# Altium schematic sheet In_Amp.SchDoc
size A
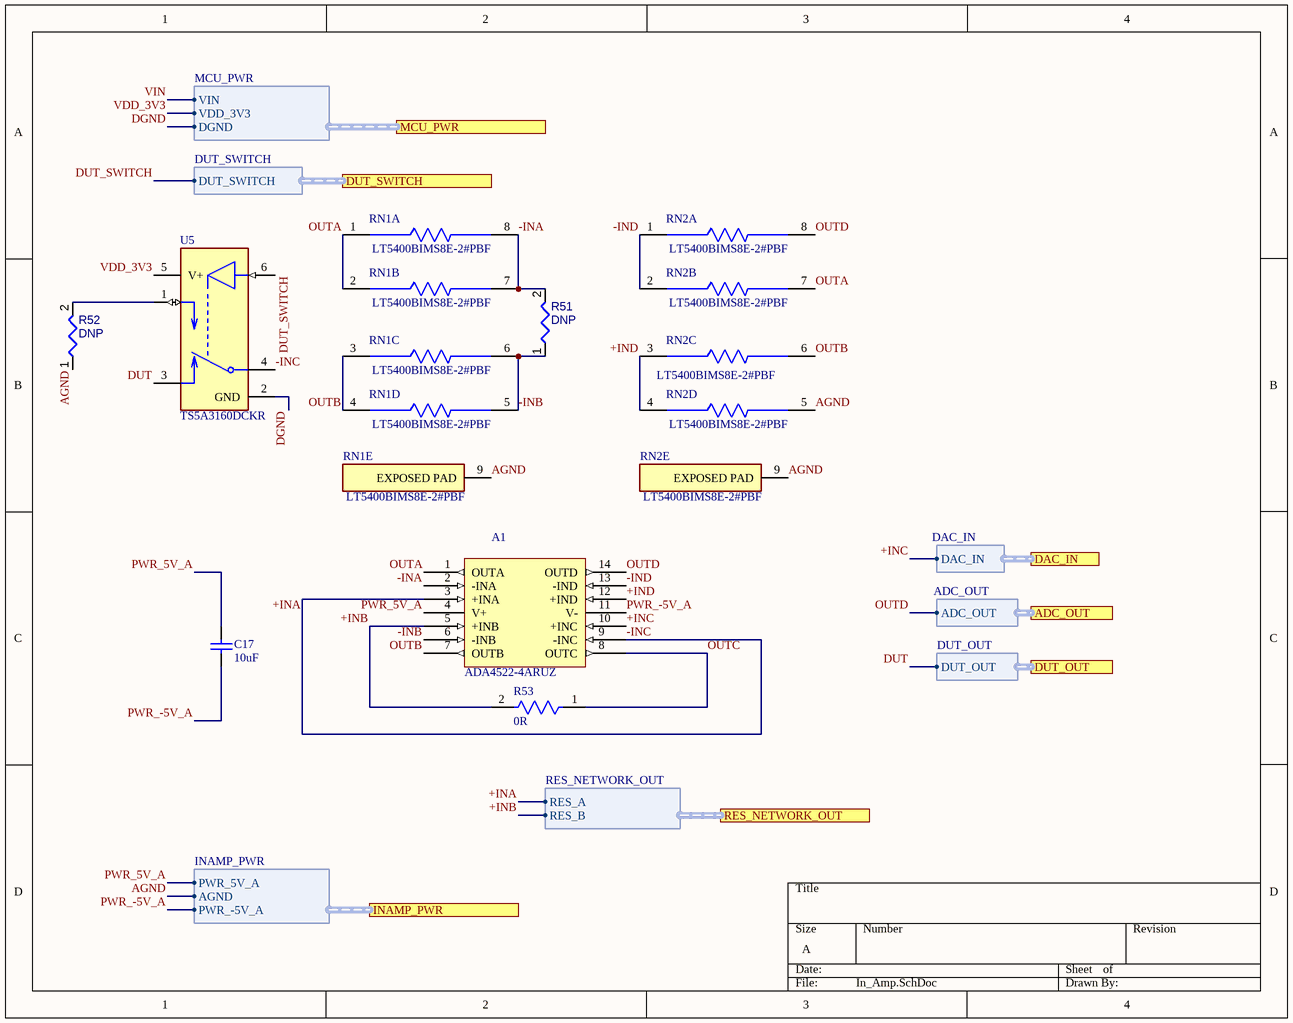
[diagram p0: In_Amp.SchDoc]

## Parts
A1  ADA4522-4ARUZ  [TSSOP14]
C17  10uF  [CAPC2013X135X45ML10T25]
R51  DNP  [RESC1608X55X25ML10T15]
R52  DNP  [RESC1608X55X25ML10T15]
R53  0R  [FP-CR0603-MFG]
RN1  LT5400BIMS8E-2#PBF  [FP-MS8E-8-05-08-1662-MFG]  (parts A,B,C,D,E of 5)
RN2  LT5400BIMS8E-2#PBF  [FP-MS8E-8-05-08-1662-MFG]  (parts A,B,C,D,E of 5)
U5  TS5A3160DCKR  [FP-DCK0006A-MFG]

## Ports
ADC_OUT (harness ADC_OUT), DAC_IN (harness DAC_IN), DUT_OUT (harness DUT_OUT), DUT_SWITCH (harness DUT_SWITCH), INAMP_PWR (harness INAMP_PWR), MCU_PWR (harness MCU_PWR), RES_NETWORK_OUT (harness RES_NETWORK_OUT)

## Harnesses
RES_NETWORK_OUT: RES_A, RES_B
DUT_OUT: DUT_OUT
INAMP_PWR: AGND, PWR_-5V_A, PWR_5V_A
MCU_PWR: VDD_3V3, DGND, VIN
DUT_SWITCH: DUT_SWITCH
DAC_IN: DAC_IN
ADC_OUT: ADC_OUT

## Nets
+INA: A1.3(+INA) A1.9(-INC) U5.4(COM) ; port RES_NETWORK_OUT.RES_A  [also labelled -INC]
+INB: A1.5(+INB) R53.2 ; port RES_NETWORK_OUT.RES_B
+INC: A1.10(+INC) ; port DAC_IN.DAC_IN
+IND: A1.12(+IND) RN2.3(1_R3) RN2.4(1_R4)
-INA: A1.2(-INA) R51.2 RN1.7(2_R2) RN1.8(2_R1)
-INB: A1.6(-INB) R51.1 RN1.5(2_R4) RN1.6(2_R3)
-IND: A1.13(-IND) RN2.1(1_R1) RN2.2(1_R2)
AGND: R52.1 RN1.9(EXPOSED_PAD) RN2.5(2_R4) RN2.9(EXPOSED_PAD) ; port INAMP_PWR.AGND
DGND: U5.2(GND) ; port MCU_PWR.DGND
DUT: U5.3(NC) ; port DUT_OUT.DUT_OUT
DUT_SWITCH: U5.6(IN) ; port DUT_SWITCH.DUT_SWITCH
OUTA: A1.1(OUTA) RN1.1(1_R1) RN1.2(1_R2) RN2.7(2_R2)
OUTB: A1.7(OUTB) RN1.3(1_R3) RN1.4(1_R4) RN2.6(2_R3)
OUTC: A1.8(OUTC) R53.1
OUTD: A1.14(OUTD) RN2.8(2_R1) ; port ADC_OUT.ADC_OUT
PWR_5V_A: A1.4(V+) C17.2 ; port INAMP_PWR.PWR_5V_A
PWR_-5V_A: A1.11(V-) C17.1 ; port INAMP_PWR.PWR_-5V_A
VDD_3V3: U5.5(V+) ; port MCU_PWR.VDD_3V3
VIN: port MCU_PWR.VIN
NetR52_2: R52.2 U5.1(NO)

## Library data of the parts
A1 = AD4522-4ARUZ: Manufacturer 1: Analog Devices; Manufacturer Part Number 1: ADA4522-4ARUZ-R7; Supplier 1: Digi-Key; Supplier Part Number 1: ADA4522-4ARUZ-R7CT-ND; Supplier Unit Price 1: 8.45000
C17 = CMP-2007-03541-1: Part Number: GRM21BR61E106KA73L; Manufacturer: Murata
R51 R52 = CMP-009-00023-4: do not place
R53 = CMP-07231-000023-1: Thick Film Chip Resistors 0603 0Ω 0.1W 5%; Power Rating: 100mW; Resistance: 0mR; Voltage Rating (DC): 50V; Tolerance: 1%; Temperature Coefficient: 500ppm/°C; Depth: 0.8mm; Height: 0.45mm; Case Code (Metric): 1608; Number of Pins: 2; Max Operating Temperature: 155°C; Mount: Surface Mount; REACH SVHC: No SVHC; Radiation Hardening: No; Width: 0.8mm; Max Power Dissipation: 100mW; Thickness: 457um; Package Quantity: 5000; Composition: Thick Film; Case/Package: 0603; Military Standard: Not; Packaging: Tape and Reel; Voltage Rating: 50V; Case Code (Imperial): 0603; Min Operating Temperature: -55°C; Contact Plating: Tin; Length: 1.6mm; Termination: SMD/SMT
RN1 RN2 = CMP-09039-000001-1: RES ARRAY 4 RES 1K OHM 8TSSOP; Manufacturer: Analog Devices; Standoff Height: 0.0508mm; Power Per Resistor: 800mW; Number Of Resistors: 4; Resistance: 1kΩ; Voltage Rating: 75V; Tolerance: 15%; Value: 100K; Temperature Coefficient: 8ppm/°C; Height: 1.1mm; Octopart: https://octopart.com/lt5400ahms8e-4%23pbf-analog+devices-88940367; Package: MS8E-8-05-08-1662; ComponentLink2URL: https://www.analog.com/media/en/technical-documentation/data-sheets/5400fc.pdf; Automotive: No; Temperature Range Low: -40°C; Digikey Description: RES ARRAY 4 RES 1K OHM 8TSSOP; Lead Free: Yes; Ipc Land Pattern Name: SOP65P490X110-8; Device Class L1: Passive Components; Category: Res; ComponentLink2Description: Datasheet; RoHS: TRUE; Device Class L2: Resistors; Device Class L3: Resistor Arrays; Termination: Gull-Wing; Series: LT5400; Manufacturer Part Number: LT5400BIMS8E-2#PBF; Temperature Range High: +125°C; Temperature: -40°C to +125°C
U5 = CMP-04892-000008-1: IC SWITCH SPDT SC70-6; Manufacturer: Texas Instruments; Nominal Supply Current: 0.01uA; On State Resistance: 0.7Ω; Standoff Height: 0mm; Number Of Circuits: 1; Min Supply Voltage: 1.65V; Max Supply Voltage: 5.5V; Package: DCK0006A; Ambient Temperature Range Low: -40°C; Temperature Range High: +85°C; Category: IC; RoHS: TRUE; Octopart: https://octopart.com/ts5a3160dckr-texas+instruments-665387; Ambient Temperature Range High: +85°C; Automotive: No; Manufacturer Part Number: TS5A3160DCKR; ComponentLink2Description: Datasheet; Height: 1.1mm; Device Class L3: Analog Switches; Temperature Range Low: -40°C; ComponentLink2URL: http://www.ti.com/lit/ds/symlink/ts5a3160.pdf; Device Class L2: Interface ICs; Temperature: -40°C to +85°C; Lead Free: Yes; Throw Configuration: SPDT; Mouser Description: 1-Ohm SPDT Analog Switch 5-V/3.3-V Single-Channel 2: 1 Multiplexer/Demultiplexer 6-SC70 -40 to 85; Digikey Description: IC SWITCH SPDT SC70-6; Device Class L1: Integrated Circuits (ICs)